# EAGLE design Olive FTDI (EAGLE 5.11)
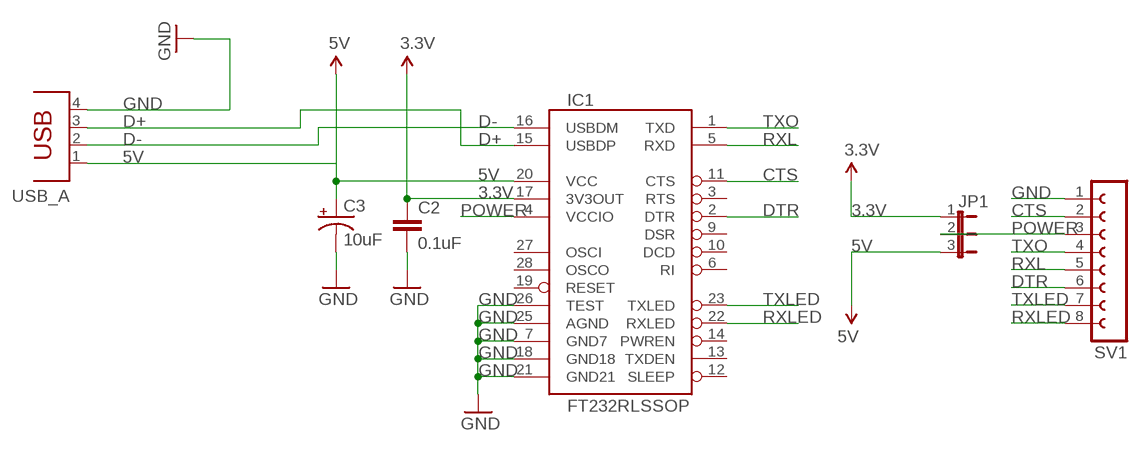
[diagram p0: schematic, sheet 1]

## Parts
C2  0.1uF  CAP0402-CAP  [0402-CAP]
C3  10uF  CAP_POL1206  [EIA3216]
IC1  FT232RLSSOP  [SSOP28DB]
JP1  JP2E  [JP2]
SV1  FE08-1  [FE08]
USB_A  PN87520  [PN87520]

## Nets
3.3V: C2.1 IC1.17(3V3OUT) JP1.1
5V: C3.A(+) IC1.20(VCC) JP1.3 USB_A.1
CTS: IC1.11(CTS) SV1.2
D+: IC1.15(USBDP) USB_A.3
D-: IC1.16(USBDM) USB_A.2
DTR: IC1.2(DTR) SV1.6
GND: C2.2 C3.C(-) IC1.7(GND7) IC1.18(GND18) IC1.21(GND21) IC1.25(AGND) IC1.26(TEST) SV1.1 USB_A.4
POWER: IC1.4(VCCIO) JP1.2 SV1.3
RXL: IC1.5(RXD) SV1.5
RXLED: IC1.22(RXLED) SV1.8
TXLED: IC1.23(TXLED) SV1.7
TXO: IC1.1(TXD) SV1.4
Unconnected: IC1.3(RTS) IC1.6(RI) IC1.9(DSR) IC1.10(DCD) IC1.12(SLEEP) IC1.13(TXDEN) IC1.14(PWREN) IC1.19(RESET) IC1.27(OSCI) IC1.28(OSCO)

## Library data of the parts
C2 = SparkFun:CAP: Capacitor Standard 0603 ceramic capacitor, and 0.1" leaded capacitor.
C3 = SparkFun:CAP_POL: Capacitor Polarized These are standard SMD and PTH capacitors. Normally 10uF, 47uF, and 100uF in electrolytic and tantalum varieties. Always verify the external diameter of the through hole cap, it varies with capacity, voltage, and manufacturer. The EIA devices should be standard.
IC1 = SparkFun:FT232RL: USB UART FT232RL 4th Generation USB UART (USB <-> Serial) Controller. Spark Fun Electronics SKU : COM-00650
JP1 = jumper:JP2E: JUMPER
SV1 = con-lsta:FE08-1: FEMALE HEADER; OC_FARNELL: unknown; OC_NEWARK: unknown
USB_A = con-berg:PN87520: BERG USB connector; OC_FARNELL: unknown; OC_NEWARK: unknown

## Board
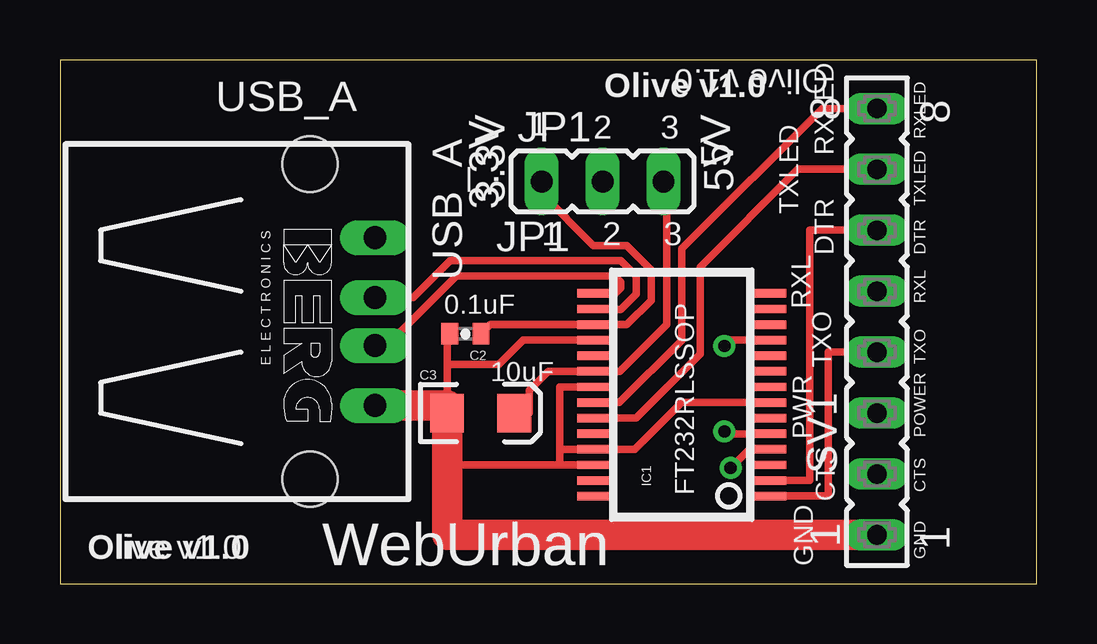
[diagram p1: board, top side]
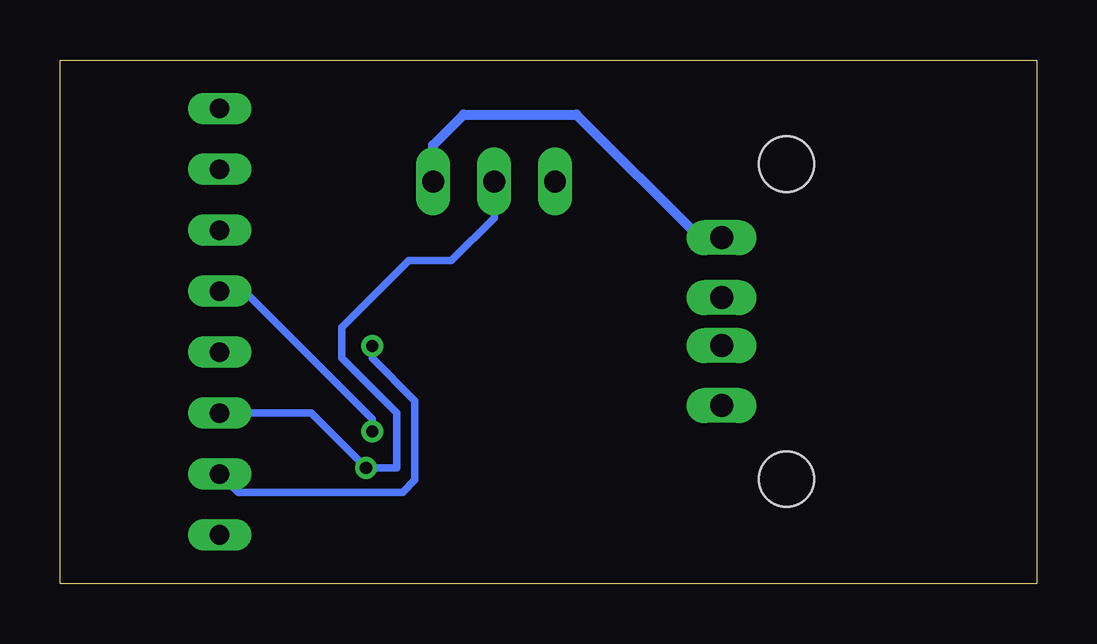
[diagram p2: board, bottom side, seen from below]

Size 40.69 x 21.83 mm. Coordinates in mm from the lower left corner, seen from the top.
Outline: 0,0 40.69,0 40.69,21.83 0,21.83 0,0
Copper layers (1*16): Top 0.035mm / dielectric 1.5mm / Bottom 0.035mm
Design rules "default": minimum track width 10mil, minimum drill 24mil, track to track 8mil, track to pad 8mil, pad to pad 8mil, via to via 8mil, smd to smd 8mil, copper to edge 40mil, drill to drill 8mil, minimum pad ring 10mil, minimum via ring 8mil, stop-mask expansion 4mil, vias tented up to drill 0mil, thermal gap 10mil

### Footprints (pad centres in the part's own frame; a part is rotated, then mirrored left to right if it is on the bottom)
0402-CAP = smd 0.7 x 0.9: 1 -0.65,0; 2 0.65,0
EIA3216 = smd 1.4 x 1.6: A 1.4,0; C -1.4,0
SSOP28DB = smd 0.348 x 1.397: 1 -4.225,-3.656; 2 -3.575,-3.656; 3 -2.925,-3.656; 4 -2.275,-3.656; 5 -1.625,-3.656; 6 -0.975,-3.656; 7 -0.325,-3.656; 8 0.325,-3.656; 9 0.975,-3.656; 10 1.625,-3.656; 11 2.275,-3.656; 12 2.925,-3.656; 13 3.575,-3.656; 14 4.225,-3.656; 15 4.225,3.656; 16 3.575,3.656; 17 2.925,3.656; 18 2.275,3.656; 19 1.625,3.656; 20 0.975,3.656; 21 0.325,3.656; 22 -0.325,3.656; 23 -0.975,3.656; 24 -1.625,3.656; 25 -2.275,3.656; 26 -2.925,3.656; 27 -3.575,3.656; 28 -4.225,3.656
JP2 = drill 0.914 long: 1 -2.54,0; 2 0,0; 3 2.54,0
FE08 = drill 0.813 long: 1 -8.89,0; 2 -6.35,0; 3 -3.81,0; 4 -1.27,0; 5 1.27,0; 6 3.81,0; 7 6.35,0; 8 8.89,0
PN87520 = drill 0.95 long: 1 -3.5,2.71; 2 -1,2.71; 3 1,2.71; 4 3.5,2.71 | hole 2.3: -6.57,0; 6.57,0

### Placement (x,y rotation side)
C2  16.89,10.41 180 top
C3  17.53,7.11 0 top
IC1  25.91,7.87 90 top
JP1  22.61,16.76 0 top
SV1  34.04,10.92 90 top
USB_A  10.41,10.92 270 top

### Tracks (layer width: path | path; a pad name or v marks a point on that pad's centre or on a via)
3.3V
  Top 0.305: C2.1 17.93,10.8 IC1.17 23.62,10.79 24.64,11.81 24.64,13.08 23.62,14.1 22.23,14.1 20.07,16.26 JP1.1
5V
  Top 0.305: C3.A 19.56,7.11 19.56,8.06 20.35,8.85 IC1.20 23.33,8.85 25.27,10.79 25.27,16.64 JP1.3
  Bottom 0.406: USB_A.1 14.04,14.42 19.18,19.56 23.88,19.56 25.15,18.29 JP1.3
CTS  (via drill 0.51)
  Top 0.305: IC1.11 27.93,10.15 v27.69,9.91
  Bottom 0.305: v27.69,9.91 27.69,9.4 25.91,7.62 25.91,4.32 26.42,3.81 33.27,3.81 SV1.2
D+
  Top 0.305: USB_A.3 13.61,9.92 16.51,12.83 23.11,12.83 23.37,12.57 23.37,12.32 23.11,12.06 22.29,12.06 IC1.15
D-
  Top 0.305: USB_A.2 14.72,11.92 16.26,13.46 23.37,13.46 24,12.83 24,12.06 23.37,11.43 22.27,11.43 IC1.16
DTR
  Top 0.305: IC1.2 31.24,4.3 31.24,14.73 SV1.6
GND
  Top 0.305: C3.C 15.86,7.11 | IC1.21 20.83,8.2 20.83,5.6 | IC1.26 20.83,4.95 | IC1.25 22.61,5.6 | IC1.7 25.91,7.55 23.95,5.59 22.25,5.59 IC1.25 | 20.83,5.6 IC1.25 | C3.C 16.13,7.42 | 20.83,4.95 20.83,5.6 | 20.83,4.95 16.13,4.95 16.13,6.6 C3.C | C3.C 16.13,9.14 | 16.13,9.14 16.13,10.3 C2.2 | IC1.18 19.29,10.15 18.29,9.14 16.13,9.14
  Top 1.27: SV1.1 16.13,2.03 16.13,6.6 16.13,7.42 USB_A.4
POWER  (via drill 0.51)
  Top 0.305: IC1.4 28.71,5.6 v27.94,4.83
  Bottom 0.305: SV1.3 30.23,7.11 v27.94,4.83 26.67,4.83 26.67,7.11 28.96,9.4 28.96,10.67 26.16,13.46 24.38,13.46 22.61,15.24 JP1.2
RXL  (via drill 0.51)
  Top 0.305: IC1.5 27.79,6.25 v27.69,6.35
  Bottom 0.305: v27.69,6.35 27.69,6.86 33.02,12.19 SV1.5
RXLED
  Top 0.305: IC1.22 23.31,7.55 25.91,10.15 25.91,13.97 31.75,19.81 SV1.8
TXLED
  Top 0.305: IC1.23 24,6.9 26.67,9.57 26.67,13.21 30.73,17.27 SV1.7
TXO
  Top 0.305: IC1.1 32,3.65 32,9.65 SV1.4

### Text on the board
tPlace: Olive v1.0 | 3.3V | 5V | RXLED | TXLED | DTR | RXL | TXO | POWER | CTS | Olive v1.0 | WebUrban | GND
_tsilk: Olive v1.0 | USB_A | 3.3V | 1 | 2 | 3 | 5V | 8 | RXLED | TXLED | JP1 | DTR | 0.1uF | RXL | TXO | 10uF | PWR | FT232RLSSOP | CTS | Olive v1.0 | WebUrban | GND | 1